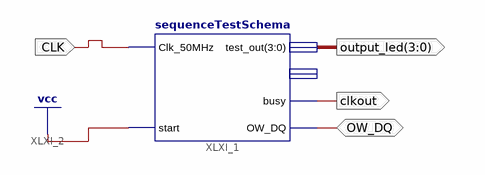
[diagram p0: schematic sheet 1]
// Xilinx ISE schematic asd.sch (spartan3e) as structural Verilog: 1 symbols, 4 ports
module asd (
  input  CLK,
  inout  OW_DQ,
  output [3:0] output_led,
  output clkout
);

  sequenceTestSchema XLXI_1 (
    .Clk_50MHz(CLK), .start(1'b1), .test_out(output_led), .busy(clkout), .OW_DQ(OW_DQ));  // open: output_data
endmodule
